# Altium schematic sheet 0_TOP_Sheet.SchDoc: TOP Sheet Kame FMU
size A3; CompanyName: Altium; Organization: Altium Training Team; Address1: Canada/Germany; Address2: UK / USA and Partner; Address3: Adv Training; Address4: (c) Altium; Revision: 2; SheetNumber: 0; SheetTotal: 9
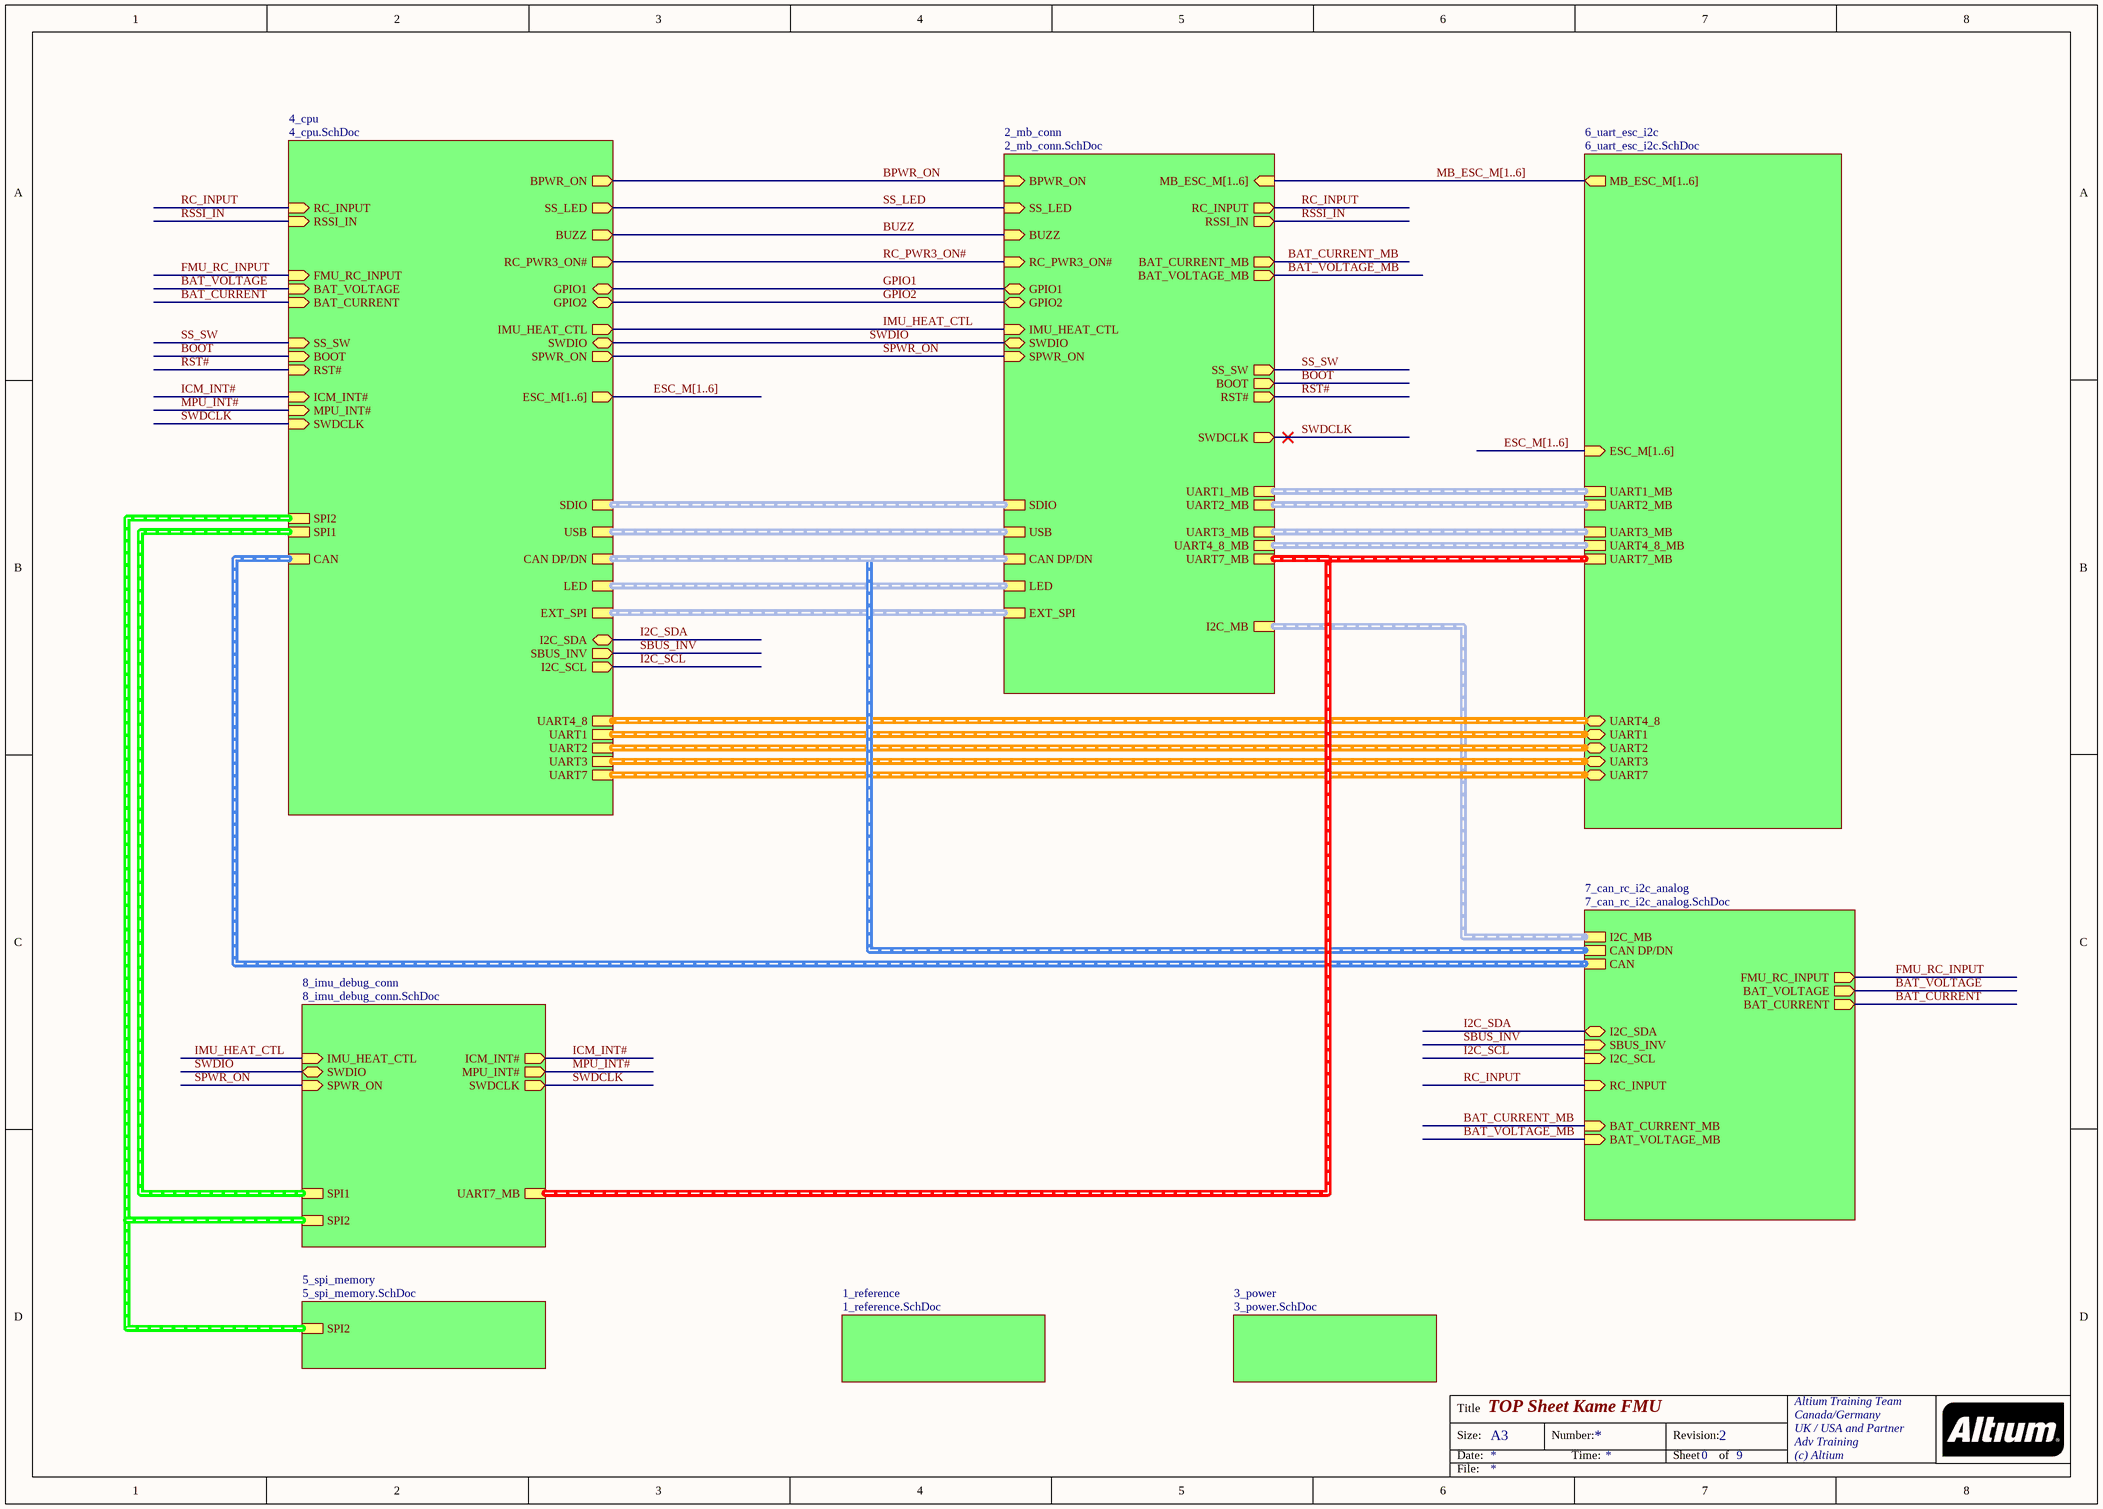
[diagram p0: 0_TOP_Sheet.SchDoc]

## Sub-sheets
1_reference = 1_reference.SchDoc: no entries
2_mb_conn = 2_mb_conn.SchDoc: BPWR_ON (in), SPWR_ON (in), RC_INPUT (out), RSSI_IN (out), BUZZ (in), BOOT (out), RST# (out), SWDIO (bidir), SWDCLK (out), SS_LED (in), BAT_CURRENT_MB (out), BAT_VOLTAGE_MB (out), RC_PWR3_ON# (in), IMU_HEAT_CTL (in), GPIO1 (bidir), GPIO2 (bidir), SS_SW (out), MB_ESC_M[1..6] (in), SDIO (harness SDIO), UART3_MB (harness UART3_MB), EXT_SPI (harness EXT_SPI), I2C_MB (harness I2C_MB), UART2_MB (harness UART2_MB), CAN DP/DN (harness CAN DP/DN), USB (harness USB), LED (harness LED), UART7_MB (harness UART7_MB), UART1_MB (harness UART1_MB), UART4_8_MB (harness UART4_8_MB)
3_power = 3_power.SchDoc: no entries
4_cpu = 4_cpu.SchDoc: RC_INPUT (in), I2C_SCL (out), I2C_SDA (bidir), BAT_VOLTAGE (in), BAT_CURRENT (in), SS_LED (out), FMU_RC_INPUT (in), SBUS_INV (out), RC_PWR3_ON# (out), GPIO2 (bidir), GPIO1 (bidir), SS_SW (in), IMU_HEAT_CTL (out), SWDIO (bidir), SWDCLK (in), BOOT (in), RST# (in), BPWR_ON (out), SPWR_ON (out), BUZZ (out), ICM_INT# (in), MPU_INT# (in), RSSI_IN (in), ESC_M[1..6] (out), LED (harness LED), SDIO (harness SDIO), CAN DP/DN (harness CAN DP/DN), USB (harness USB), SPI2 (harness SPI2), EXT_SPI (harness EXT_SPI), UART4_8 (harness UART4_8), UART1 (harness UART1), UART2 (harness UART2), UART3 (harness UART3), UART7 (harness UART7), SPI1 (harness SPI1), CAN (harness CAN)
5_spi_memory = 5_spi_memory.SchDoc: SPI2 (harness SPI2)
6_uart_esc_i2c = 6_uart_esc_i2c.SchDoc: MB_ESC_M[1..6] (out), ESC_M[1..6] (in), UART2 (bidir, harness UART2), UART3 (bidir, harness UART3), UART1 (bidir, harness UART1), UART4_8 (bidir, harness UART4_8), UART7 (bidir, harness UART7), UART3_MB (harness UART3_MB), UART2_MB (harness UART2_MB), UART7_MB (harness UART7_MB), UART4_8_MB (harness UART4_8_MB), UART1_MB (harness UART1_MB)
7_can_rc_i2c_analog = 7_can_rc_i2c_analog.SchDoc: FMU_RC_INPUT (out), BAT_VOLTAGE (out), BAT_CURRENT (out), SBUS_INV (in), RC_INPUT (in), BAT_CURRENT_MB (in), BAT_VOLTAGE_MB (in), I2C_SCL (in), I2C_SDA (bidir), CAN DP/DN (harness CAN DP/DN), I2C_MB (harness I2C_MB), CAN (harness CAN)
8_imu_debug_conn = 8_imu_debug_conn.SchDoc: ICM_INT# (out), MPU_INT# (out), IMU_HEAT_CTL (in), SWDCLK (out), SWDIO (bidir), SPWR_ON (in), SPI2 (harness SPI2), UART7_MB (harness UART7_MB), SPI1 (harness SPI1)

## Nets
BAT_CURRENT: sheet 4_cpu/BAT_CURRENT, sheet 7_can_rc_i2c_analog/BAT_CURRENT
BAT_CURRENT_MB: sheet 2_mb_conn/BAT_CURRENT_MB, sheet 7_can_rc_i2c_analog/BAT_CURRENT_MB
BAT_VOLTAGE: sheet 4_cpu/BAT_VOLTAGE, sheet 7_can_rc_i2c_analog/BAT_VOLTAGE
BAT_VOLTAGE_MB: sheet 2_mb_conn/BAT_VOLTAGE_MB, sheet 7_can_rc_i2c_analog/BAT_VOLTAGE_MB
BOOT: sheet 2_mb_conn/BOOT, sheet 4_cpu/BOOT
BPWR_ON: sheet 2_mb_conn/BPWR_ON, sheet 4_cpu/BPWR_ON
BUZZ: sheet 2_mb_conn/BUZZ, sheet 4_cpu/BUZZ
FMU_RC_INPUT: sheet 4_cpu/FMU_RC_INPUT, sheet 7_can_rc_i2c_analog/FMU_RC_INPUT
GPIO1: sheet 2_mb_conn/GPIO1, sheet 4_cpu/GPIO1
GPIO2: sheet 2_mb_conn/GPIO2, sheet 4_cpu/GPIO2
I2C_SCL: sheet 4_cpu/I2C_SCL, sheet 7_can_rc_i2c_analog/I2C_SCL
I2C_SDA: sheet 4_cpu/I2C_SDA, sheet 7_can_rc_i2c_analog/I2C_SDA
ICM_INT#: sheet 4_cpu/ICM_INT#, sheet 8_imu_debug_conn/ICM_INT#
IMU_HEAT_CTL: sheet 2_mb_conn/IMU_HEAT_CTL, sheet 4_cpu/IMU_HEAT_CTL, sheet 8_imu_debug_conn/IMU_HEAT_CTL
MPU_INT#: sheet 4_cpu/MPU_INT#, sheet 8_imu_debug_conn/MPU_INT#
RC_INPUT: sheet 2_mb_conn/RC_INPUT, sheet 4_cpu/RC_INPUT, sheet 7_can_rc_i2c_analog/RC_INPUT
RC_PWR3_ON#: sheet 2_mb_conn/RC_PWR3_ON#, sheet 4_cpu/RC_PWR3_ON#
RSSI_IN: sheet 2_mb_conn/RSSI_IN, sheet 4_cpu/RSSI_IN
RST#: sheet 2_mb_conn/RST#, sheet 4_cpu/RST#
SBUS_INV: sheet 4_cpu/SBUS_INV, sheet 7_can_rc_i2c_analog/SBUS_INV
SPWR_ON: sheet 2_mb_conn/SPWR_ON, sheet 4_cpu/SPWR_ON, sheet 8_imu_debug_conn/SPWR_ON
SS_LED: sheet 2_mb_conn/SS_LED, sheet 4_cpu/SS_LED
SS_SW: sheet 2_mb_conn/SS_SW, sheet 4_cpu/SS_SW
SWDCLK: sheet 2_mb_conn/SWDCLK, sheet 4_cpu/SWDCLK, sheet 8_imu_debug_conn/SWDCLK
SWDIO: sheet 2_mb_conn/SWDIO, sheet 4_cpu/SWDIO, sheet 8_imu_debug_conn/SWDIO

## Buses and harness runs
bus ESC_M[1..6] = sheet 4_cpu/ESC_M[1..6]
bus ESC_M[1..6] = sheet 6_uart_esc_i2c/ESC_M[1..6]
bus MB_ESC_M[1..6] = sheet 2_mb_conn/MB_ESC_M[1..6] = sheet 6_uart_esc_i2c/MB_ESC_M[1..6]
harness sheet 2_mb_conn/CAN DP/DN = sheet 4_cpu/CAN DP/DN = sheet 7_can_rc_i2c_analog/CAN DP/DN
harness sheet 2_mb_conn/EXT_SPI = sheet 4_cpu/EXT_SPI
harness sheet 2_mb_conn/I2C_MB = sheet 7_can_rc_i2c_analog/I2C_MB
harness sheet 2_mb_conn/LED = sheet 4_cpu/LED
harness sheet 2_mb_conn/SDIO = sheet 4_cpu/SDIO
harness sheet 2_mb_conn/UART1_MB = sheet 6_uart_esc_i2c/UART1_MB
harness sheet 2_mb_conn/UART2_MB = sheet 6_uart_esc_i2c/UART2_MB
harness sheet 2_mb_conn/UART3_MB = sheet 6_uart_esc_i2c/UART3_MB
harness sheet 2_mb_conn/UART4_8_MB = sheet 6_uart_esc_i2c/UART4_8_MB
harness sheet 2_mb_conn/UART7_MB = sheet 6_uart_esc_i2c/UART7_MB = sheet 8_imu_debug_conn/UART7_MB
harness sheet 2_mb_conn/USB = sheet 4_cpu/USB
harness sheet 4_cpu/CAN = sheet 7_can_rc_i2c_analog/CAN
harness sheet 4_cpu/SPI1 = sheet 8_imu_debug_conn/SPI1
harness sheet 4_cpu/SPI2 = sheet 5_spi_memory/SPI2 = sheet 8_imu_debug_conn/SPI2
harness sheet 4_cpu/UART1 = sheet 6_uart_esc_i2c/UART1
harness sheet 4_cpu/UART2 = sheet 6_uart_esc_i2c/UART2
harness sheet 4_cpu/UART3 = sheet 6_uart_esc_i2c/UART3
harness sheet 4_cpu/UART4_8 = sheet 6_uart_esc_i2c/UART4_8
harness sheet 4_cpu/UART7 = sheet 6_uart_esc_i2c/UART7

## Notes on the sheet
- Title
- Size:
- Date:
- A3
- Number:
- Time:
- Revision:
- Sheet
- of
- File: